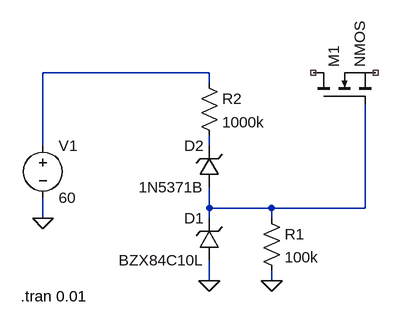
[diagram p0: schematic Draft2.asc]
Draft2.asc, the LTspice schematic file:
Version 4
SHEET 1 880 680
WIRE 160 16 -96 16
WIRE 160 32 160 16
WIRE -96 128 -96 16
WIRE 160 128 160 112
WIRE 160 224 160 192
WIRE 256 224 160 224
WIRE 400 224 400 64
WIRE 400 224 256 224
WIRE -96 240 -96 208
WIRE 160 240 160 224
WIRE 256 240 256 224
WIRE 160 336 160 304
WIRE 256 336 256 320
FLAG 160 336 0
FLAG -96 240 0
FLAG 256 336 0
DATAFLAG 304 224 ""
SYMBOL res 144 16 R0
SYMATTR InstName R2
SYMATTR Value 1000k
SYMBOL zener 176 304 R180
WINDOW 0 24 64 Left 2
WINDOW 3 24 0 Left 2
SYMATTR InstName D1
SYMATTR Value BZX84C10L
SYMATTR Description Diode
SYMATTR Type diode
SYMBOL voltage -96 112 R0
WINDOW 123 0 0 Left 0
WINDOW 39 0 0 Left 0
SYMATTR InstName V1
SYMATTR Value 60
SYMBOL zener 176 192 R180
WINDOW 0 24 64 Left 2
WINDOW 3 24 0 Left 2
SYMATTR InstName D2
SYMATTR Value 1N5371B
SYMATTR Description Diode
SYMATTR Type diode
SYMBOL nmos 320 64 R270
SYMATTR InstName M1
SYMBOL res 240 224 R0
SYMATTR InstName R1
SYMATTR Value 100k
TEXT -130 360 Left 2 !.tran 0.01

The netlist it stands for:
* Draft2.asc
R2 N001 N002 1000k
D1 0 N003 BZX84C10L
V1 N001 0 60
D2 N003 N002 1N5371B
M1 NC_01 N003 NC_02 NC_02 NMOS
R1 N003 0 100k
.model D D
.lib standard.dio
.model NMOS NMOS
.model PMOS PMOS
.lib standard.mos
.tran 0.01
.backanno
.end